# EAGLE design RH023.1 (EAGLE 7.1.0)
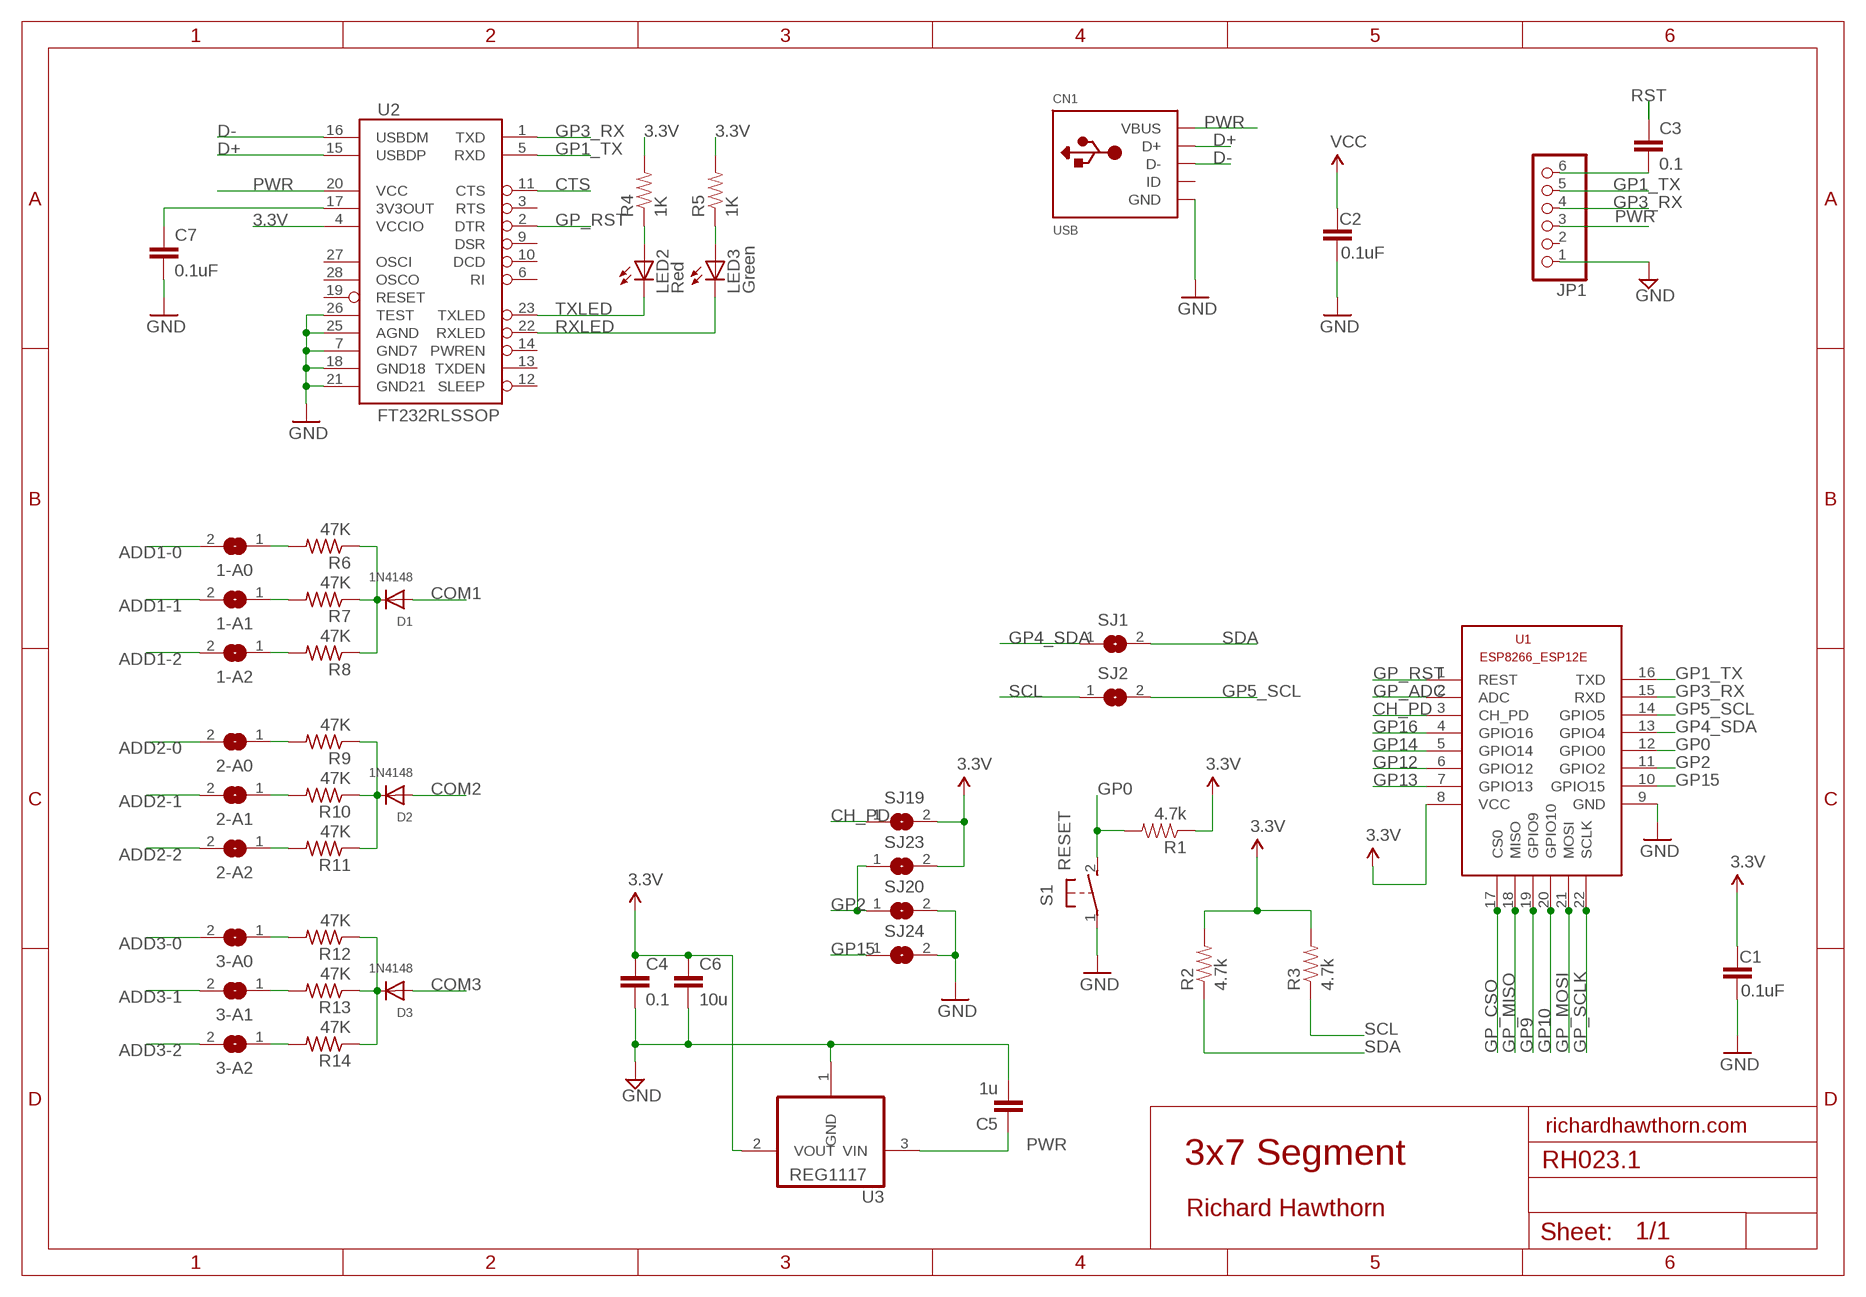
[diagram p0: schematic, sheet 1, part 1 of 2]
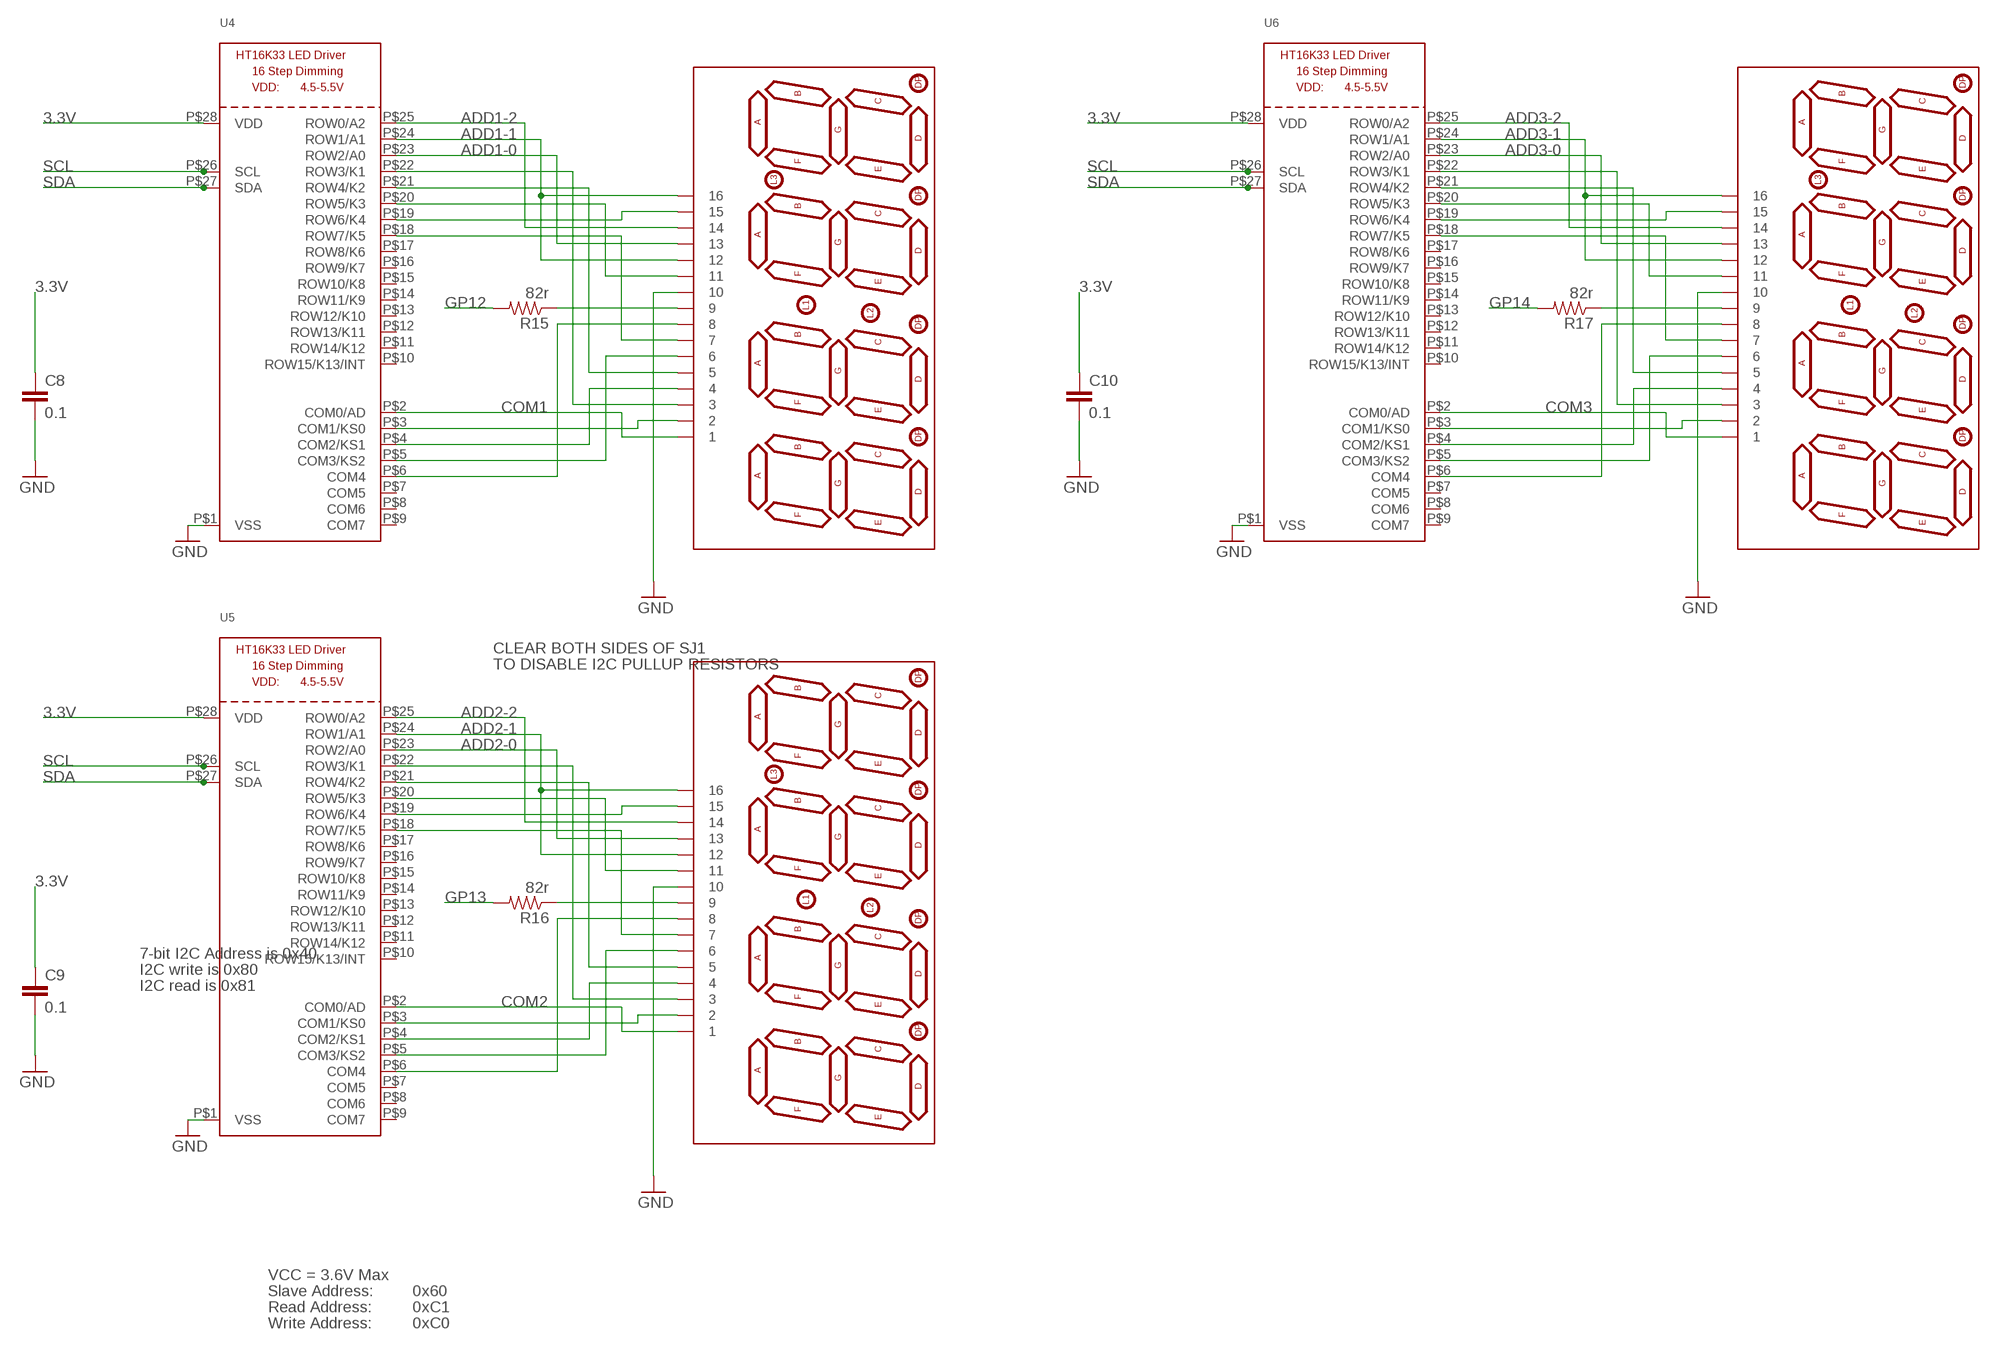
[diagram p1: schematic, sheet 1, part 2 of 2]

## Parts
1-A0  SOLDERJUMPERREFLOW_NOPASTE  [SOLDERJUMPER_REFLOW_NOPASTE]
1-A1  SOLDERJUMPERREFLOW_NOPASTE  [SOLDERJUMPER_REFLOW_NOPASTE]
1-A2  SOLDERJUMPERREFLOW_NOPASTE  [SOLDERJUMPER_REFLOW_NOPASTE]
2-A0  SOLDERJUMPERREFLOW_NOPASTE  [SOLDERJUMPER_REFLOW_NOPASTE]
2-A1  SOLDERJUMPERREFLOW_NOPASTE  [SOLDERJUMPER_REFLOW_NOPASTE]
2-A2  SOLDERJUMPERREFLOW_NOPASTE  [SOLDERJUMPER_REFLOW_NOPASTE]
3-A0  SOLDERJUMPERREFLOW_NOPASTE  [SOLDERJUMPER_REFLOW_NOPASTE]
3-A1  SOLDERJUMPERREFLOW_NOPASTE  [SOLDERJUMPER_REFLOW_NOPASTE]
3-A2  SOLDERJUMPERREFLOW_NOPASTE  [SOLDERJUMPER_REFLOW_NOPASTE]
C1  0.1uF  0.1UF-25V(+80/-20%)(0603)  [0603-CAP]
C2  0.1uF  0.1UF-25V(+80/-20%)(0603)  [0603-CAP]
C3  0.1  CAP0603-CAP  [0603-CAP]
C4  0.1  CAP0603-CAP  [0603-CAP]
C5  1u  CAP0603-CAP  [0603-CAP]
C6  10u  CAP0805-CAP  [0805-CAP]
C7  0.1uF  CAP0402-CAP  [0402-CAP]
C8  0.1  CAP0603-CAP  [0603-CAP]
C9  0.1  CAP0603-CAP  [0603-CAP]
C10  0.1  CAP0603-CAP  [0603-CAP]
CN1  USB  USBMINIB  [USB-MINIB]
D1  1N4148  DIODESOD-323F  [SOD-323F]
D2  1N4148  DIODESOD-323F  [SOD-323F]
D3  1N4148  DIODESOD-323F  [SOD-323F]
JP1  PINHD-1X6  [1X06]
LED1  7SEG-4DIGIT  [SPARKFUN_7-SEGMENT-4DIGIT]
LED2  Red  LED0603  [LED-0603]
LED3  Green  LED0603  [LED-0603]
LED4  7SEG-4DIGIT  [SPARKFUN_7-SEGMENT-4DIGIT]
LED5  7SEG-4DIGIT  [SPARKFUN_7-SEGMENT-4DIGIT]
R1  4.7k  RESISTOR0805-RES  [0805]
R2  4.7k  RESISTOR0805-RES  [0805]
R3  4.7k  RESISTOR0805-RES  [0805]
R4  1K  RESISTOR0402-RES  [0402-RES]
R5  1K  RESISTOR0402-RES  [0402-RES]
R6  47K  R-US_R0805  [R0805]
R7  47K  R-US_R0805  [R0805]
R8  47K  R-US_R0805  [R0805]
R9  47K  R-US_R0805  [R0805]
R10  47K  R-US_R0805  [R0805]
R11  47K  R-US_R0805  [R0805]
R12  47K  R-US_R0805  [R0805]
R13  47K  R-US_R0805  [R0805]
R14  47K  R-US_R0805  [R0805]
R15  82r  RESISTOR0805-RES  [0805]
R16  82r  RESISTOR0805-RES  [0805]
R17  82r  RESISTOR0805-RES  [0805]
S1  RESET  DTSM-3  [DTSM-3]
SJ1  SJ  [SJ]
SJ2  SJ  [SJ]
SJ19  SJ  [SJ]
SJ20  SJ  [SJ]
SJ23  SJ  [SJ]
SJ24  SJ  [SJ]
U1  ESP8266-12EESP8266-ESP12E  [ESP8266-ESP12E]
U2  FT232RLSSOP  [SSOP28DB]
U3  REG1117  [SOT223]
U4  HT16K33_SOP28  [SOP28_300MIL]
U5  HT16K33_SOP28  [SOP28_300MIL]
U6  HT16K33_SOP28  [SOP28_300MIL]

## Nets
3.3V: C1.1 C2.1 C4.1 C6.1 C8.1 C9.1 C10.1 R1.1 R2.2 R3.2 R4.2 R5.2 SJ19.2 SJ23.2 U1.8(VCC) U2.4(VCCIO) U3.2(VOUT) U4.P$28(VDD) U5.P$28(VDD) U6.P$28(VDD) ; supply symbol labelled VCC
3.3VOUT: C7.1 U2.17(3V3OUT)
ADD1-0: 1-A0.2 LED1.13 U4.P$23(ROW2/A0)
ADD1-1: 1-A1.2 LED1.12 LED1.16 U4.P$24(ROW1/A1)
ADD1-2: 1-A2.2 LED1.14 U4.P$25(ROW0/A2)
ADD2-0: 2-A0.2 LED4.13 U5.P$23(ROW2/A0)
ADD2-1: 2-A1.2 LED4.12 LED4.16 U5.P$24(ROW1/A1)
ADD2-2: 2-A2.2 LED4.14 U5.P$25(ROW0/A2)
ADD3-0: 3-A0.2 LED5.13 U6.P$23(ROW2/A0)
ADD3-1: 3-A1.2 LED5.12 LED5.16 U6.P$24(ROW1/A1)
ADD3-2: 3-A2.2 LED5.14 U6.P$25(ROW0/A2)
CH_PD: SJ19.1 U1.3(CH_PD)
COM1: D1.A LED1.1 U4.P$2(COM0/AD)
COM2: D2.A LED4.1 U5.P$2(COM0/AD)
COM3: D3.A LED5.1 U6.P$2(COM0/AD)
CTS: U2.11(CTS)
D+: CN1.D+ U2.15(USBDP)
D-: CN1.D- U2.16(USBDM)
GND [power]: C1.2 C2.2 C4.2 C5.2 C6.2 C7.2 C8.2 C9.2 C10.2 CN1.GND JP1.1 LED1.10 LED4.10 LED5.10 S1.1 SJ20.2 SJ24.2 U1.9(GND) U2.7(GND7) U2.18(GND18) U2.21(GND21) U2.25(AGND) U2.26(TEST) U3.1(GND) U4.P$1(VSS) U5.P$1(VSS) U6.P$1(VSS)
GP0: R1.2 S1.2 U1.12(GPIO0)
GP1_TX: JP1.5 U1.16(TXD) U2.5(RXD)
GP2: SJ20.1 SJ23.1 U1.11(GPIO2)
GP3_RX: JP1.4 U1.15(RXD) U2.1(TXD)
GP4_SDA: SJ1.1 U1.13(GPIO4)
GP5_SCL: SJ2.2 U1.14(GPIO5)
GP9: U1.19(GPIO9)
GP10: U1.20(GPIO10)
GP12: R15.2 U1.6(GPIO12)
GP13: R16.2 U1.7(GPIO13)
GP14: R17.2 U1.5(GPIO14)
GP15: SJ24.1 U1.10(GPIO15)
GP16: U1.4(GPIO16)
GP_ADC: U1.2(ADC)
GP_CSO: U1.17(CS0)
GP_MISO: U1.18(MISO)
GP_MOSI: U1.21(MOSI)
GP_RST: U1.1(REST) U2.2(DTR)
GP_SCLK: U1.22(SCLK)
N$1: LED1.9 R15.1
N$2: LED2.A R4.1
N$3: LED3.A R5.1
N$4: 2-A1.1 R10.2
N$5: 1-A0.1 R6.2
N$6: LED1.11 U4.P$20(ROW5/K3)
N$7: LED1.2 U4.P$3(COM1/KS0)
N$8: LED1.4 U4.P$4(COM2/KS1)
N$9: LED1.6 U4.P$5(COM3/KS2)
N$10: LED1.8 U4.P$6(COM4)
N$11: LED1.3 U4.P$22(ROW3/K1)
N$12: LED1.5 U4.P$21(ROW4/K2)
N$13: 2-A0.1 R9.2
N$14: LED1.7 U4.P$18(ROW7/K5)
N$15: LED1.15 U4.P$19(ROW6/K4)
N$16: D2.C R9.1 R10.1 R11.1
N$17: D1.C R6.1 R7.1 R8.1
N$18: 1-A2.1 R8.2
N$19: 1-A1.1 R7.2
N$20: C3.2 JP1.6
N$21: 2-A2.1 R11.2
N$22: 3-A1.1 R13.2
N$23: 3-A0.1 R12.2
N$24: D3.C R12.1 R13.1 R14.1
N$25: 3-A2.1 R14.2
N$26: LED4.2 U5.P$3(COM1/KS0)
N$27: LED4.4 U5.P$4(COM2/KS1)
N$28: LED4.6 U5.P$5(COM3/KS2)
N$29: LED4.8 U5.P$6(COM4)
N$30: LED4.3 U5.P$22(ROW3/K1)
N$31: LED4.5 U5.P$21(ROW4/K2)
N$32: LED4.15 U5.P$19(ROW6/K4)
N$33: LED4.11 U5.P$20(ROW5/K3)
N$34: LED4.7 U5.P$18(ROW7/K5)
N$35: LED4.9 R16.1
N$36: LED5.2 U6.P$3(COM1/KS0)
N$37: LED5.4 U6.P$4(COM2/KS1)
N$38: LED5.6 U6.P$5(COM3/KS2)
N$39: LED5.8 U6.P$6(COM4)
N$40: LED5.3 U6.P$22(ROW3/K1)
N$41: LED5.5 U6.P$21(ROW4/K2)
N$42: LED5.15 U6.P$19(ROW6/K4)
N$43: LED5.11 U6.P$20(ROW5/K3)
N$44: LED5.7 U6.P$18(ROW7/K5)
N$45: LED5.9 R17.1
PWR [power]: C5.1 CN1.VBUS JP1.3 U2.20(VCC) U3.3(VIN)
RST: C3.1
RXLED: LED3.C U2.22(RXLED)
SCL: R3.1 SJ2.1 U4.P$26(SCL) U5.P$26(SCL) U6.P$26(SCL)
SDA: R2.1 SJ1.2 U4.P$27(SDA) U5.P$27(SDA) U6.P$27(SDA)
TXLED: LED2.C U2.23(TXLED)
Unconnected: CN1.ID JP1.2 U2.3(RTS) U2.6(RI) U2.9(DSR) U2.10(DCD) U2.12(SLEEP) U2.13(TXDEN) U2.14(PWREN) U2.19(RESET) U2.27(OSCI) U2.28(OSCO) U4.P$7(COM5) U4.P$8(COM6) U4.P$9(COM7) U4.P$10(ROW15/K13/INT) U4.P$11(ROW14/K12) U4.P$12(ROW13/K11) U4.P$13(ROW12/K10) U4.P$14(ROW11/K9) U4.P$15(ROW10/K8) U4.P$16(ROW9/K7) U4.P$17(ROW8/K6) U5.P$7(COM5) U5.P$8(COM6) U5.P$9(COM7) U5.P$10(ROW15/K13/INT) U5.P$11(ROW14/K12) U5.P$12(ROW13/K11) U5.P$13(ROW12/K10) U5.P$14(ROW11/K9) U5.P$15(ROW10/K8) U5.P$16(ROW9/K7) U5.P$17(ROW8/K6) U6.P$7(COM5) U6.P$8(COM6) U6.P$9(COM7) U6.P$10(ROW15/K13/INT) U6.P$11(ROW14/K12) U6.P$12(ROW13/K11) U6.P$13(ROW12/K10) U6.P$14(ROW11/K9) U6.P$15(ROW10/K8) U6.P$16(ROW9/K7) U6.P$17(ROW8/K6)

## Notes on the sheet
- CLEAR BOTH SIDES OF SJ1
- TO DISABLE I2C PULLUP RESISTORS
- 7-bit I2C Address is 0x40
- I2C write is 0x80
- I2C read is 0x81
- richardhawthorn.com
- 3x7 Segment
- Richard Hawthorn
- VCC = 3.6V Max
- Slave Address: | 0x60
- Read Address: | 0xC1
- Write Address: | 0xC0

## Library data of the parts
1-A0 1-A1 1-A2 2-A0 2-A1 2-A2 3-A0 3-A1 3-A2 = microbuilder:SOLDERJUMPER: SMD Solder JUMPER Solder the two pads together to create a connection, or remove the solder to break it. REFLOW - Use this footprint for solder paste and reflow ovens. WAVE - Use this footprint for hand-soldering (larger pads). CLOSED - Has a trace between the two pads to ensure it is closed by default. The trace needs to be cut to disable the jumper, and can be closed again by creating a solder bridge between the two pads.
C1 C2 = SparkFun-Capacitors:0.1UF-25V(+80/-20%)(0603): Ceramic Standard decoupling cap CAP-00810; PROD_ID: CAP-00810
C3-C6 C8-C10 = LowPowerLab:CAP: Capacitor Standard 0603 ceramic capacitor, and 0.1" leaded capacitor.
C7 = SparkFun:CAP: Capacitor Standard 0603 ceramic capacitor, and 0.1" leaded capacitor.
CN1 = LowPowerLab:USB: USB Connectors USBMINIB - Surface Mount Female Mini-B USB Connector 4UConnector: 06564 By microbuilder.eu Thru-hole RA Female Mini-B USB Connector 4UConnector: 18732 By ladyada.net
D1-D3 = adafruit:DIODE: Diode SMADIODE - SMA Surface Mount Package 20V 1A Schottky Diode Digikey: 641-1014-6-ND DO-1N4148 - Through Hole Small Current Diode SOD-123 20V 1 A (.5mV Vf) Schottky Diode - Digikey: MBRX120TPMSCT-ND SOD-323 10V 570mA (.38mV Vf, 3ns) Schottky Diode - Digikey: ZLLS410CT-ND SOD-523 30V 30mA Schottky Diode (RB751S-40TE61) - Digikey: RB751S-40TE61CT-ND SOT23-R/W - SOT23 Package (R = Solder Paste/Reflow Ovens, W = Hand-Soldering) BAT54Film 40V 300mA - Digikey: 497-7162-1-ND
JP1 = Richards:PINHD-1X6: PIN HEADER
LED1 LED4 LED5 = sparkfun-4digit-sseg:7SEG-4DIGIT
LED2 LED3 = SparkFun:LED: LEDs Standard schematic elements and footprints for 5mm, 3mm, 1206, and 0603 sized LEDs. 5mm - Spark Fun Electronics SKU : COM-00529 (and others)
R1-R5 R15-R17 = SparkFun:RESISTOR: Resistor Basic schematic elements and footprints for 0603, 1206, and PTH resistors.
R6-R14 = adafruit:R-US_: RESISTOR, American symbol
S1 = switch-tact:DTSM-3
SJ1 SJ2 SJ19 SJ20 SJ23 SJ24 = jumper:SJ: SMD solder JUMPER
U1 = ESP8266-ESP12E:ESP8266-12E: ESP8266-12E with additional I/O and GPIO04/05 corrected The author cannot warrant that this library is free from error or will meet your specific requirements. Created by PuceBaboon.com. Komagane, Nagano, JAPAN
U2 = SparkFun:FT232RL: USB UART FT232RL 4th Generation USB UART (USB <-> Serial) Controller. Spark Fun Electronics SKU : COM-00650
U3 = burr-brown:REG1117: 800mA and 1A Low Dropout (LDO) Positive Regulator 1.8V, 2.5V, 2.85V, 3.3V, 5V, and Adj; MPN: REG1117; OC_FARNELL: 1097566; OC_NEWARK: 14P6981
U4-U6 = microbuilder:HT16K33_SOP28

## Net classes
1 power: width 0.381 mm, clearance 0.254 mm

## Board
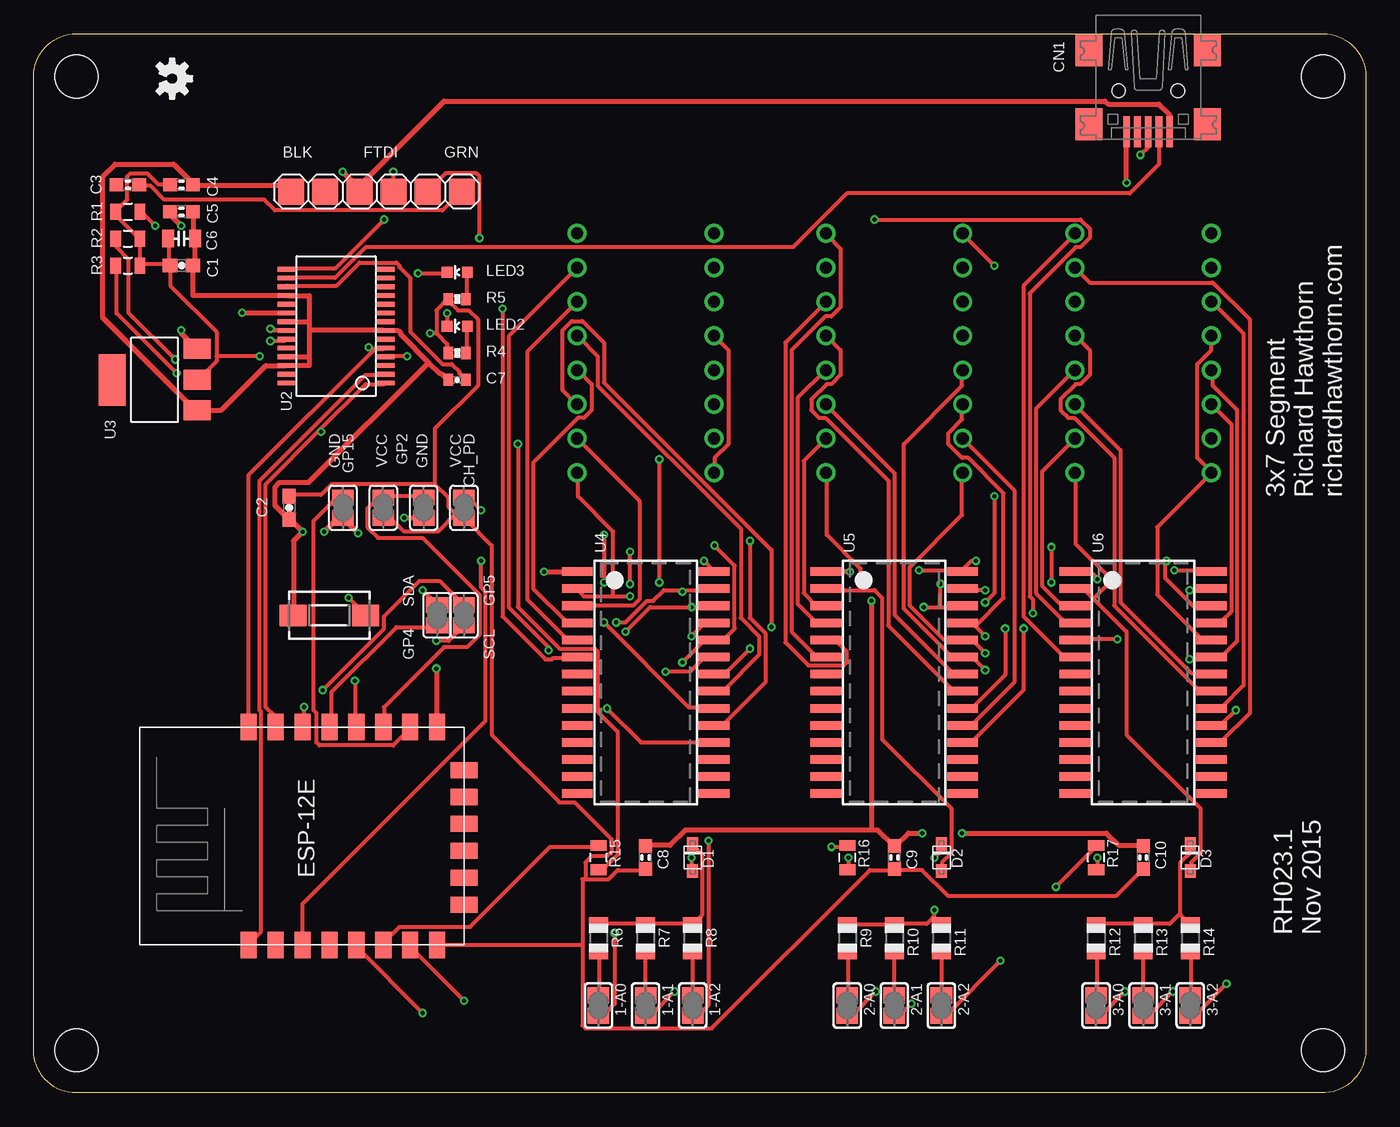
[diagram p2: board, top side]
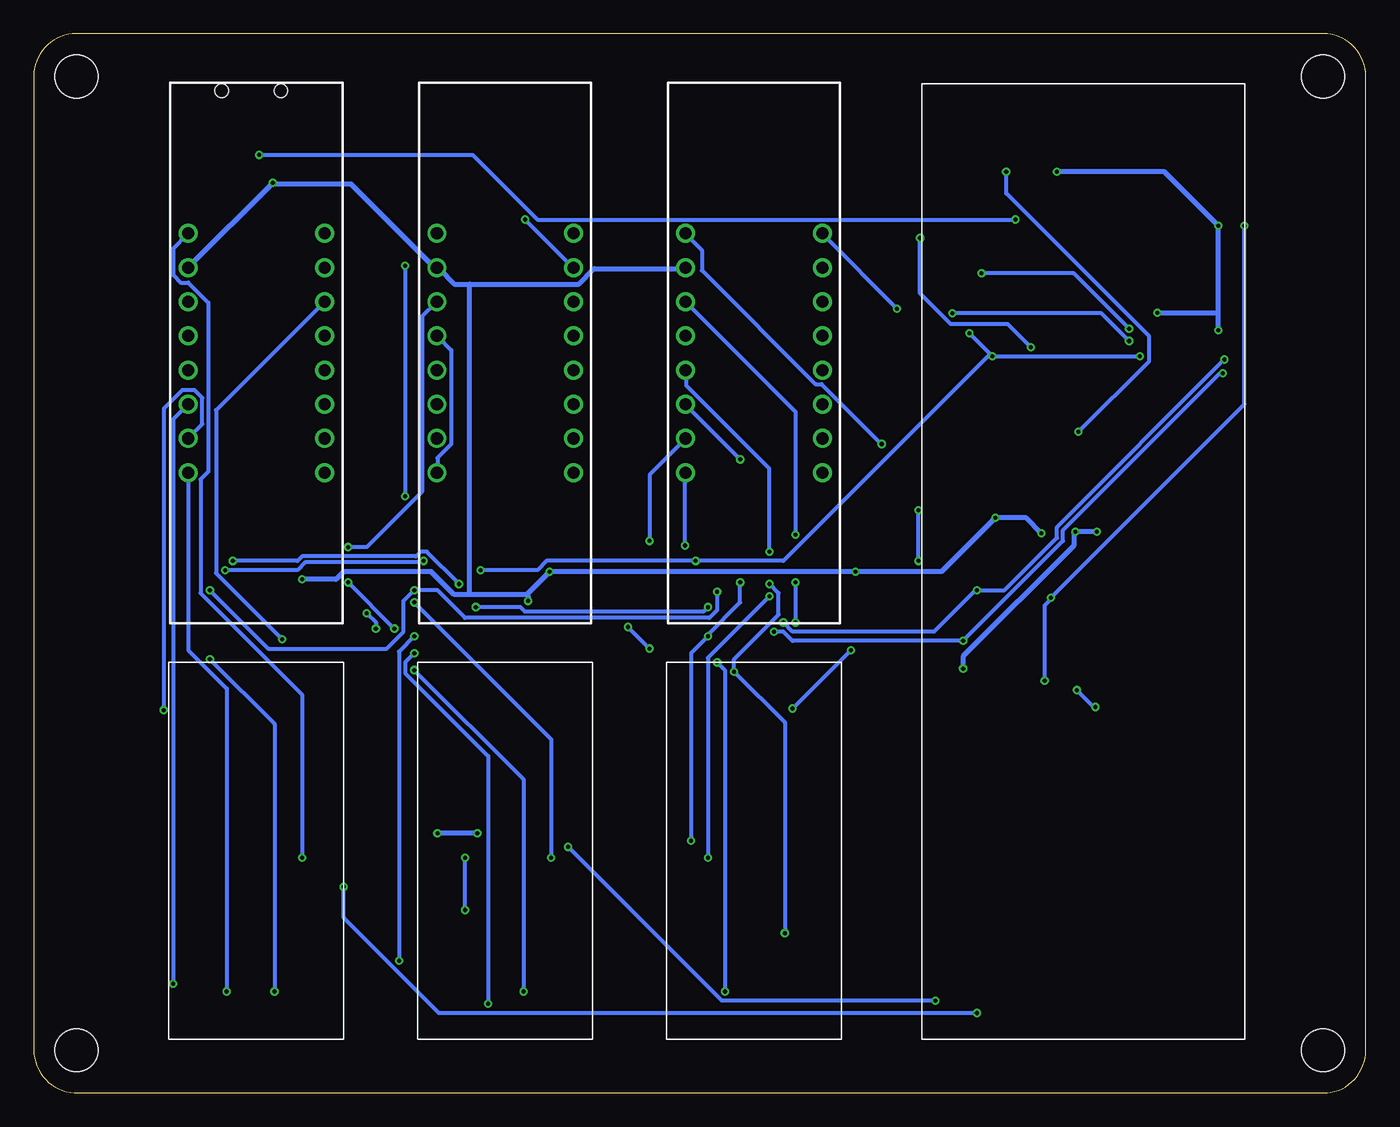
[diagram p3: board, bottom side, seen from below]

Size 99.06 x 78.74 mm. Coordinates in mm from the lower left corner, seen from the top.
Outline: 0,3.17 0,75.56 arc-90 3.17,78.74 95.89,78.74 arc-90 99.06,75.56 99.06,3.17 arc-90 95.76,0 3.17,0 arc-90 0,3.17
Copper layers (1*16): Top 0.035mm / dielectric 1.5mm / Bottom 0.035mm
Design rules "ITEADstudio_DRC *": minimum track width 12mil, minimum drill 12mil, track to track 6mil, track to pad 6mil, pad to pad 6mil, via to via 6mil, smd to smd 0mil, copper to edge 10mil, drill to drill 10mil, minimum pad ring 10mil, minimum via ring 6mil, stop-mask expansion 2mil, vias tented up to drill 100mil, thermal gap 15mil
Holes 3.2 mm at 3.17,3.17 95.89,3.17 3.17,75.56 95.89,75.56
tRestrict: area 0,0 to 15.5,30.5
bRestrict: area 0,0 to 15.5,30.5

### Footprints (pad centres in the part's own frame; a part is rotated, then mirrored left to right if it is on the bottom)
SOLDERJUMPER_REFLOW_NOPASTE = smd 1.168 x 1.6: 1 -0.762,0; 2 0.762,0
0603-CAP = smd 1.1 x 1: 1 -0.85,0; 2 0.85,0
0603-CAP' = smd 1.016 x 0.965: 1 -0.85,0; 2 0.85,0
0805-CAP = smd 0.902 x 1.3: 1 -1,0; 2 1,0
0402-CAP = smd 0.7 x 0.9: 1 -0.65,0; 2 0.65,0
USB-MINIB = smd 0.5 x 2.308: D+ 0,4.064; D- -0.8,4.064; GND 1.6,4.064; ID 0.8,4.064; VBUS -1.6,4.064 | smd 2 x 2.4: GND1 -4.4,-2; GND2 -4.4,3.5; GND3 4.4,3.5; GND4 4.4,-2 | hole 1: -2.2,1; 2.2,1
SOD-323F = smd 1 x 0.8: A -1,0; C 1,0
1X06 = smd 1.93 x 1.93: 1 -6.35,0; 2 -3.81,0; 3 -1.27,0; 4 1.27,0; 5 3.81,0; 6 6.35,0
SPARKFUN_7-SEGMENT-4DIGIT = drill 0.9: 1 -8.89,-5.08; 2 -6.35,-5.08; 3 -3.81,-5.08; 4 -1.27,-5.08; 5 1.27,-5.08; 6 3.81,-5.08; 7 6.35,-5.08; 8 8.89,-5.08; 9 8.89,5.08; 10 6.35,5.08; 11 3.81,5.08; 12 1.27,5.08; 13 -1.27,5.08; 14 -3.81,5.08; 15 -6.35,5.08; 16 -8.89,5.08
LED-0603 = smd 0.8 x 0.8: A 0,-0.75; C 0,0.75
0805 = smd 0.8 x 1.2: 1 -0.9,0; 2 0.9,0
0402-RES = smd 0.7 x 0.9: 1 -0.65,0; 2 0.65,0
R0805 = smd 1.1 x 1.4: 1 -1,0; 2 1,0
DTSM-3 = smd 2 x 1.6: 1 -2.7,0; 2 2.7,0
SJ = smd 1.168 x 1.6: 1 -0.762,0; 2 0.762,0
ESP8266-ESP12E = smd 2 x 1.2: 1 0,16; 2 0,14; 3 0,12; 4 0,10; 5 0,8; 6 0,6; 7 0,4; 8 0,2; 9 16.2,2; 10 16.2,4; 11 16.2,6; 12 16.2,8; 13 16.2,10; 14 16.2,12; 15 16.2,14; 16 16.2,16 | smd 1.2 x 2: 17 11,0; 18 3,0; 19 5,0; 20 13,0; 21 7,0; 22 9,0
SSOP28DB = smd 0.348 x 1.397: 1 -4.225,-3.656; 2 -3.575,-3.656; 3 -2.925,-3.656; 4 -2.275,-3.656; 5 -1.625,-3.656; 6 -0.975,-3.656; 7 -0.325,-3.656; 8 0.325,-3.656; 9 0.975,-3.656; 10 1.625,-3.656; 11 2.275,-3.656; 12 2.925,-3.656; 13 3.575,-3.656; 14 4.225,-3.656; 15 4.225,3.656; 16 3.575,3.656; 17 2.925,3.656; 18 2.275,3.656; 19 1.625,3.656; 20 0.975,3.656; 21 0.325,3.656; 22 -0.325,3.656; 23 -0.975,3.656; 24 -1.625,3.656; 25 -2.275,3.656; 26 -2.925,3.656; 27 -3.575,3.656; 28 -4.225,3.656
SOT223 = smd 1.499 x 2.007: 1 -2.261,-3.15; 2 0.025,-3.15; 3 2.311,-3.15 | smd 3.81 x 2.007: 4 0,3.15
SOP28_300MIL = smd 0.635 x 2.286: P$1 -8.255,-5.08; P$2 -6.985,-5.08; P$3 -5.715,-5.08; P$4 -4.445,-5.08; P$5 -3.175,-5.08; P$6 -1.905,-5.08; P$7 -0.635,-5.08; P$8 0.635,-5.08; P$9 1.905,-5.08; P$10 3.175,-5.08; P$11 4.445,-5.08; P$12 5.715,-5.08; P$13 6.985,-5.08; P$14 8.255,-5.08; P$15 8.255,5.08; P$16 6.985,5.08; P$17 5.715,5.08; P$18 4.445,5.08; P$19 3.175,5.08; P$20 1.905,5.08; P$21 0.635,5.08; P$22 -0.635,5.08; P$23 -1.905,5.08; P$24 -3.175,5.08; P$25 -4.445,5.08; P$26 -5.715,5.08; P$27 -6.985,5.08; P$28 -8.255,5.08

### Placement (x,y rotation side)
1-A0  42,6.5 270 top
1-A1  45.5,6.5 270 top
1-A2  49,6.5 270 top
2-A0  60.5,6.5 270 top
2-A1  64,6.5 270 top
2-A2  67.5,6.5 270 top
3-A0  79,6.5 270 top
3-A1  82.5,6.5 270 top
3-A2  86,6.5 270 top
C1  11,61.5 0 top
C2  19,43.5 270 top
C3  0.1  [0603-CAP']  7,67.5 0 top
C4  0.1  [0603-CAP']  11,67.5 0 top
C5  1u  [0603-CAP']  11,65.5 0 top
C6  11,63.5 0 top
C7  31.5,53 180 top
C8  0.1  [0603-CAP']  45.5,17.5 90 top
C9  0.1  [0603-CAP']  64,17.5 90 top
C10  0.1  [0603-CAP']  82.5,17.5 90 top
CN1  82.87,75.5 180 top
D1  49,17.5 90 top
D2  67.5,17.5 90 top
D3  86,17.5 90 top
JP1  25.5,67 0 top
LED1  45.5,55 90 bottom
LED2  31.5,57 90 top
LED3  31.5,61 90 top
LED4  64,55 90 bottom
LED5  82.5,55 90 bottom
R1  7,65.5 0 top
R2  7,63.5 0 top
R3  7,61.5 0 top
R4  31.5,55 180 top
R5  31.5,59 180 top
R6  42,11.5 270 top
R7  45.5,11.5 270 top
R8  49,11.5 270 top
R9  60.5,11.5 270 top
R10  64,11.5 270 top
R11  67.5,11.5 270 top
R12  79,11.5 270 top
R13  82.5,11.5 270 top
R14  86,11.5 270 top
R15  42,17.5 90 top
R16  60.5,17.5 90 top
R17  79,17.5 90 top
S1  22,35.5 0 top
SJ1  30,35.5 90 top
SJ2  32,35.5 90 top
SJ19  32,43.5 270 top
SJ20  29,43.5 270 top
SJ23  26,43.5 270 top
SJ24  23,43.5 270 top
U1  32,11 90 top
U2  22.5,57 90 top
U3  9,53 90 top
U4  45.5,30.5 270 top
U5  64,30.5 270 top
U6  82.5,30.5 270 top
U$3  [OSHW-LOGO-S]  10.3,75.4 270 top

### Tracks (layer width: path | path; a pad name or v marks a point on that pad's centre or on a via)
3.3V  (via drill 0.3)
  Top 0.305: C10.1 82.41,16.57 80.47,14.63 68.01,14.63 66.06,16.57 64.01,16.57 C9.1 63.89,16.57 62.18,16.57 50.41,4.8 41.03,4.8 40.8,5.03 40.8,10.97 | 41.03,15.89 40.8,15.89 40.8,10.97 | 41.03,15.89 42.75,15.89 43.43,16.57 45.49,16.57 C8.1 | C4.1 10.06,67.55 9.26,67.55 8.46,68.35 7.2,68.35 6.97,68.12 6.97,66.41 6.17,65.61 R1.1 6.17,65.38 6.17,65.15 7.77,63.55 R2.2 7.89,63.44 7.89,61.61 R3.2 8,61.61 9.94,61.61 C1.1 | C1.1 10.06,61.61 10.06,63.44 C6.1 | 13.6,54.75 13.6,56.58 10.17,60.01 10.17,61.38 C1.1 | 13.6,54.75 13.6,54.41 12.23,53.03 U3.2 | 29.83,45.26 22.17,45.26 21.37,44.46 19.09,44.46 C2.1 | 29.83,45.26 30.86,44.23 30.86,43.55 31.66,42.75 31.89,42.75 SJ19.2 | SJ23.2 26.06,42.63 26.63,42.63 27.55,41.72 30.06,41.72 31.32,42.98 SJ19.2 | 29.95,56.46 30.75,55.66 30.75,55.09 R4.2 | 29.95,56.46 29.95,58.18 30.75,58.98 R5.2 30.86,58.86 31.55,58.18 32.35,58.18 33.03,57.49 33.03,52.58 29.83,49.38 29.83,45.26 | v27.77,54.75 26.18,54.75 U2.4 | 29.95,56.46 v29.49,56.46 | v49.84,39.55 50.52,38.86 U4.P$28 | v65.84,38.86 69.04,38.86 U5.P$28 69.15,38.98 69.72,39.55 v70.07,39.55 | v84.81,38.86 87.55,38.86 U6.P$28 | v16.8,54.75 13.6,54.75 | 40.8,10.97 30.06,10.97 U1.8 | 41.03,15.89 41.03,17.14 41.49,17.6 42.63,17.6 42.98,17.95 42.98,18.86 40.23,21.6 39.09,21.6 34.06,26.63 34.06,40.69 32.12,42.63 SJ19.2
  Bottom 0.305: v29.49,56.46 v27.77,54.75 | v27.77,54.75 28,54.86 43.32,39.55 v49.84,39.55 60.92,39.55 61.61,38.86 v65.84,38.86 | v84.81,38.86 79.44,38.86 78.87,39.43 70.18,39.43 v70.07,39.55 | v27.77,54.75 v16.8,54.75
3.3VOUT
  Top 0.305: C7.1 32.12,53.03 31.66,53.49 31.66,53.61 31.09,54.18 30.4,54.18 28,56.58 28,60.58 27.2,61.38 27.2,61.49 26.98,61.72 24.23,61.72 22.52,60.01 18.86,60.01 U2.17
ADD1-0  (via drill 0.3)
  Top 0.305: v43.2,11.89 43.2,6.63 42.41,5.83 42.06,5.83 1-A0.2 | v46.98,31.32 48.81,31.32 49.84,32.35 50.52,32.35 U4.P$23 | v44.35,37.83 v44.35,40.23
  Bottom 0.305: v43.2,11.89 43.2,27.55 v46.98,31.32 46.98,32.23 43.66,35.55 43.66,37.15 v44.35,37.83 | v44.35,40.23 44.35,46.41 50.52,52.58 50.52,53.72 LED1.13
ADD1-1  (via drill 0.3)
  Top 0.305: LED1.16 50.63,46.18 50.63,47.21 51.66,48.23 51.66,55.21 50.63,56.24 LED1.12 | v47.66,7.54 45.95,5.83 45.61,5.83 1-A1.2 | v48.23,32 49.84,33.6 50.52,33.6 U4.P$24 50.63,33.72 51.32,33.72 52.12,34.52 52.12,39.2 v50.63,40.69
  Bottom 0.305: v47.66,7.54 47.66,31.43 v48.23,32 | v50.63,40.69 50.63,46.06 LED1.16
ADD1-2  (via drill 0.3)
  Top 0.305: v50.18,18.75 50.18,6.51 49.49,5.83 49.03,5.83 1-A2.2 | v48.92,33.95 49.84,34.86 50.52,34.86 U4.P$25 | v46.52,37.95 v46.52,47.09
  Bottom 0.305: v50.18,18.75 50.18,32.69 v48.92,33.95 48.92,34.06 46.52,36.46 v46.52,37.95 | v46.52,47.09 50.52,51.09 LED1.14
ADD2-0  (via drill 0.3)
  Top 0.305: v62.64,7.54 60.92,5.83 60.58,5.83 2-A0.2 | v70.75,31.43 69.84,32.35 69.15,32.35 U5.P$23 69.04,32.46 68.24,32.46 64.69,36.01 64.69,48.23 69.04,52.58 69.04,53.72 LED4.13
  Bottom 0.305: v62.64,7.54 62.64,23.32 v70.75,31.43
ADD2-1  (via drill 0.3)
  Top 0.305: v65.27,6.63 64.47,5.83 64.01,5.83 2-A1.2 | v70.75,32.69 69.84,33.6 69.15,33.6 U5.P$24 69.04,33.72 67.67,33.72 65.15,36.23 65.15,39.09 69.04,42.98 69.04,46.06 LED4.16
  Bottom 0.305: LED4.16 69.04,46.18 69.04,47.21 68.01,48.23 68.01,55.21 69.04,56.24 LED4.12 | v65.27,6.63 65.27,25.03 71.44,31.2 71.44,32 v70.75,32.69
ADD2-2  (via drill 0.3)
  Top 0.305: v71.89,9.83 67.89,5.83 67.55,5.83 2-A2.2 | v70.75,33.95 69.84,34.86 69.15,34.86 U5.P$25 70.07,34.75 72.12,36.8 72.12,44.58 69.49,47.21 69.04,47.21 68.01,48.23 68.01,49.03 69.04,50.06 69.04,51.09 LED4.14
  Bottom 0.305: v71.89,9.83 71.89,32.8 v70.75,33.95
ADD3-0  (via drill 0.3)
  Top 0.305: v81.15,7.54 79.44,5.83 79.1,5.83 3-A0.2 | v85.95,32.23 87.44,32.23 87.55,32.35 U6.P$23 87.67,32.46 88.35,32.46 89.5,33.6 89.5,50.75 87.67,52.58 87.67,53.72 LED5.13
  Bottom 0.305: v81.15,7.54 81.15,27.43 v85.95,32.23
ADD3-1  (via drill 0.3)
  Top 0.305: v84.7,7.54 82.98,5.83 82.53,5.83 3-A1.2 | U6.P$24 87.55,33.72 86.87,33.72 83.55,37.03 83.55,42.06 87.55,46.06 LED5.16 87.55,46.18 86.53,47.21 86.53,54.18 87.55,55.21 87.55,56.24 LED5.12
  Bottom 0.305: v84.7,7.54 84.7,30.06 87.55,32.92 87.55,46.06 LED5.16
ADD3-2  (via drill 0.3)
  Top 0.305: v88.7,8.12 86.41,5.83 86.07,5.83 3-A2.2 | U6.P$25 87.67,34.98 88.24,34.98 89.04,35.78 89.04,49.72 87.67,51.09 LED5.14
  Bottom 0.305: v88.7,8.12 88.7,50.06 87.67,51.09 LED5.14
CH_PD  (via drill 0.3)
  Top 0.305: v33.26,43.32 32.35,44.23 32,44.23 SJ19.1 | v33.26,39.55 33.26,37.6 33.6,37.26 33.6,27.66 20,14.06 20,11.09 U1.3
  Bottom 0.305: v33.26,39.55 v33.26,43.32
COM1  (via drill 0.3)
  Top 0.305: v48.92,17.49 48.92,16.57 D1.A | 43.09,36.92 40.92,36.92 40.46,37.38 U4.P$2 | 43.09,36.92 v44.35,36.92 | 43.09,36.92 43.09,41.72 40.46,44.35 40.46,46.06 LED1.1
  Bottom 0.305: v48.92,17.49 48.92,32.35 v44.35,36.92
COM2
  Top 0.305: 61.49,37.38 58.98,37.38 U5.P$2 | 61.49,37.38 62.52,37.38 63.09,36.8 63.09,26.29 68.24,21.14 68.24,17.83 67.55,17.14 67.55,16.57 D2.A | 61.49,37.38 61.49,38.98 58.98,41.49 58.98,46.06 LED4.1
COM3
  Top 0.305: 78.81,36.75 78.18,37.38 77.5,37.38 U6.P$2 | 78.81,36.75 81.27,34.29 81.27,26.63 86.75,21.14 86.75,17.83 86.07,17.14 86.07,16.57 D3.A | 78.81,36.75 79.9,37.83 79.9,38.41 77.5,40.8 77.5,46.06 LED5.1
D+  (via drill 0.3)
  Top 0.305: v26.06,64.92 22.4,61.27 18.86,61.27 U2.15 | v82.3,69.72 82.87,70.29 82.87,71.32 CN1.D+
  Bottom 0.305: v26.06,64.92 61.61,64.92 66.41,69.72 v82.3,69.72
D-
  Top 0.305: U2.16 18.86,60.58 22.4,60.58 24.69,62.87 56.46,62.87 60.47,66.86 81.5,66.86 83.67,69.04 83.67,71.32 CN1.D-
GND  (via drill 0.3)
  Top 0.381: 20.5,57.33 20.5,59.27 U2.18 11.85,59.27 C1.2 12,61.61 12,63.32 C6.2 11.89,63.55 11.89,65.49 C5.2 | 20.5,57.33 20.5,56.69 | 20.5,56.69 20.5,54.73 | 20.5,54.73 20.5,54.08 U2.26 18.75,54.06 17.26,54.06 13.95,50.75 12.34,50.75 U3.1 12,50.75 5.14,57.61 5.14,68.12 6.06,69.04 10.4,69.04 11.77,67.67 C4.2 11.89,67.44 18.75,67.44 19.09,67.09 JP1.1 | U2.25 20.5,54.73 | U2.21 20.5,57.33 | v81.27,67.67 81.27,71.32 CN1.GND | 29.38,54.29 27.32,56.35 27.32,56.46 27.09,56.69 26.18,56.69 U2.7 26.06,56.69 20.5,56.69 | 29.38,54.29 30.18,53.49 30.29,53.49 30.75,53.03 C7.2 | v69.04,19.32 79.78,19.32 80.7,18.4 82.41,18.4 C10.2 | v66.06,19.32 65.04,19.32 64.12,18.4 C9.2 63.89,18.4 62.75,19.55 62.29,19.55 | 29.38,54.29 20.46,45.38 18.29,45.38 17.95,45.03 17.95,43.66 18.86,42.75 C2.2 19.09,42.63 v20,41.72 19.32,41.03 19.32,35.55 S1.1 | 62.29,19.55 48.46,19.55 47.32,18.4 45.61,18.4 C8.2 | v21.6,41.72 22.52,42.63 22.97,42.63 SJ24.2 23.09,42.63 v24.12,41.6 | v27.55,42.75 28.92,42.75 SJ20.2 | v29.95,31.55 29.95,27.2 U1.9 | v37.95,38.75 40.35,38.75 U4.P$1 | v60.69,38.75 58.98,38.75 U5.P$1 | v79.1,38.18 78.52,38.75 77.5,38.75 U6.P$1 | v62.29,36.58 62.29,19.55
  Bottom 0.381: LED5.10 87.55,61.38 v81.27,67.67 81.15,67.55 75.44,67.55 69.27,61.38 LED4.10 68.92,61.27 67.78,60.12 66.64,60.12 | v66.06,19.32 v69.04,19.32 | 66.64,60.12 58.52,60.12 57.38,61.27 50.63,61.27 LED1.10 | v20,41.72 v21.6,41.72 21.72,41.6 21.72,40.69 29.95,32.46 v29.95,31.55 | v24.12,41.6 25.26,42.75 v27.55,42.75 31.55,38.75 v37.95,38.75 v60.69,38.75 62.41,37.03 | v79.1,38.18 76.58,38.18 76.01,38.75 69.49,38.75 67.78,37.03 66.64,37.03 | 62.41,37.03 66.64,37.03 | v62.29,36.58 62.29,36.92 62.41,37.03 | 66.64,37.03 66.64,60.12
GP0  (via drill 0.3)
  Top 0.305: v9.03,64.47 8,65.49 R1.2 | v23.43,36.8 24.69,35.55 S1.2 | v23.89,30.63 23.89,27.2 U1.12
  Bottom 0.305: v9.03,64.47 9.03,51.21 v23.43,36.8 23.43,36.69 23.89,36.23 v23.89,30.63
GP1_TX  (via drill 0.3)
  Top 0.305: 25.2,55.15 16,45.95 U1.16 | 25.2,55.15 25.38,55.32 26.06,55.32 U2.5 | v33.15,63.55 33.15,68.12 32.92,68.35 30.63,68.35 29.38,67.09 JP1.5 | 25.2,55.15 v24.92,55.44
  Bottom 0.305: v33.15,63.55 33.15,59.44 30.86,57.15 26.63,57.15 v24.92,55.44
GP2
  Top 0.305: SJ20.1 28.92,44.35 26.06,44.35 SJ23.1 25.95,44.12 25.49,44.12 24.8,43.43 24.8,42.06 25.6,41.26 28.92,41.26 33.15,37.03 33.15,34.06 32.23,33.15 30.52,33.15 26.06,28.69 26.06,27.2 U1.11
GP3_RX  (via drill 0.3)
  Top 0.305: 21.2,49.21 17.26,45.26 17.26,28.69 17.95,28 17.95,27.2 U1.15 | 21.2,49.21 24.69,52.69 26.06,52.69 U2.1 | v26.75,68.47 26.75,67.09 JP1.4 | v21.37,49.15 21.26,49.15 21.2,49.21
  Bottom 0.305: v26.75,68.47 26.75,66.86 16.12,56.24 16.12,54.41 v21.37,49.15
GP4_SDA
  Top 0.305: SJ1.1 29.95,34.63 26.98,34.63 22.17,29.83 22.17,27.32 22.06,27.2 U1.13
GP5_SCL  (via drill 0.3)
  Top 0.305: v21.49,29.95 26.06,34.52 26.06,35.43 28.69,38.06 30.18,38.06 31.89,36.35 SJ2.2 | v20.12,28.69 20.12,27.32 U1.14
  Bottom 0.305: v21.49,29.95 20.23,28.69 v20.12,28.69
GP12
  Top 0.305: R15.2 41.95,18.29 38.41,18.29 32.46,12.34 27.2,12.34 25.95,11.09 U1.6
GP13  (via drill 0.3)
  Top 0.305: v59.32,18.29 60.47,18.29 R16.2 | v32,6.86 27.89,10.97 U1.7
  Bottom 0.305: v59.32,18.29 47.89,6.86 v32,6.86
GP14  (via drill 0.3)
  Top 0.305: v76.01,15.32 78.98,18.29 R17.2 | v28.92,5.94 23.89,10.97 U1.5
  Bottom 0.305: v76.01,15.32 76.01,13.03 68.92,5.94 v28.92,5.94
GP15
  Top 0.305: SJ24.1 22.97,44.23 22.52,44.23 20.8,42.52 20.8,28.46 21.03,28.23 21.03,26.06 21.26,25.83 26.75,25.83 28,27.09 U1.10
GP_RST
  Top 0.305: U2.2 26.06,53.38 24.69,53.38 16.8,45.49 16.8,28.46 16.92,28.35 16.92,12 16,11.09 U1.1
N$1  (via drill 0.3)
  Top 0.305: v36.01,48.23 36.01,36.12 39.09,33.03 41.72,33.03 41.95,32.8 41.95,28.35 43.43,26.86 43.43,17.72 42.41,16.69 42.06,16.69 R15.1
  Bottom 0.305: v36.01,48.23 40.46,52.69 40.92,52.69 49.38,61.15 49.38,62.64 50.52,63.78 LED1.9
N$2
  Top 0.305: LED2.A 32.23,56.92 32.23,55.09 R4.1
N$3
  Top 0.305: LED3.A 32.23,60.92 32.23,59.09 R5.1
N$4
  Top 0.305: R10.2 64.01,10.4 64.01,7.32 2-A1.1
N$5
  Top 0.305: R6.2 42.06,10.4 42.06,7.32 1-A0.1
N$6  (via drill 0.3)
  Top 0.305: v42.41,34.98 48.69,28.69 50.52,28.69 U4.P$20 | v42.41,41.49 v42.41,37.95
  Bottom 0.305: v42.41,37.95 v42.41,34.98 | v42.41,41.49 42.41,50.63 50.52,58.75 LED1.11
N$7
  Top 0.305: U4.P$3 40.46,36.23 44.58,36.23 45.03,36.69 45.03,44.01 40.46,48.58 LED1.2
N$8
  Top 0.305: U4.P$4 40.35,34.98 39.66,34.98 37.15,37.49 37.15,46.86 40.46,50.18 40.92,50.18 41.49,50.75 41.49,52.69 40.46,53.72 LED1.4
N$9
  Top 0.305: U4.P$5 40.35,33.72 39.66,33.72 36.69,36.69 36.69,55.09 40.35,58.75 LED1.6
N$10  (via drill 0.3)
  Top 0.305: v34.86,58.29 34.86,35.43 38.06,32.23 38.52,32.23 38.63,32.35 40.35,32.35 U4.P$6
  Bottom 0.305: v34.86,58.29 40.35,63.78 LED1.8
N$11  (via drill 0.3)
  Top 0.305: v53.26,33.03 51.44,31.2 50.63,31.2 U4.P$22 | v54.86,34.63 54.86,40.35 42.41,52.81 42.41,55.78 40.8,57.38 40.01,57.38 39.32,56.69 39.32,52.23 40.35,51.21 LED1.3
  Bottom 0.305: v54.86,34.63 v53.26,33.03
N$12
  Top 0.305: U4.P$21 50.63,29.95 51.32,29.95 53.95,32.58 53.95,33.95 52.58,35.32 52.58,41.95 41.95,52.58 41.95,54.75 40.46,56.24 LED1.5
N$13
  Top 0.305: R9.2 60.58,9.94 60.58,7.32 2-A0.1
N$14  (via drill 0.3)
  Top 0.305: v42.63,28.57 45.15,26.06 50.52,26.06 U4.P$18 | v38.29,32.92 38.29,33.15 35.32,36.12 35.32,56.24 40.35,61.27 LED1.7
  Bottom 0.305: v38.29,32.92 v42.63,28.57
N$15  (via drill 0.3)
  Top 0.305: v53.26,41.03 53.26,35.32 54.41,34.18 54.41,30.52 51.32,27.43 50.63,27.43 U4.P$19
  Bottom 0.305: v53.26,41.03 53.26,45.95 50.63,48.58 LED1.15
N$16  (via drill 0.3)
  Top 0.305: R9.1 60.58,12.5 63.44,12.5 63.89,12.46 R10.1 64.12,12.57 66.41,12.57 66.86,13.03 R11.1 67.44,12.57 66.98,13.03 v66.98,13.6 | v66.98,17.49 67.44,17.95 67.44,18.4 D2.C
  Bottom 0.305: v66.98,13.6 v66.98,17.49
N$17
  Top 0.305: R6.1 42.06,12.57 45.49,12.57 R7.1 45.61,12.57 48.92,12.57 R8.1 49.03,12.57 49.72,13.26 49.72,17.72 49.03,18.4 D1.C
N$18
  Top 0.305: R8.2 49.03,10.4 49.03,7.32 1-A2.1
N$19
  Top 0.305: R7.2 45.49,10.4 45.49,7.32 1-A1.1
N$20
  Top 0.305: C3.2 7.89,67.44 8.69,67.44 9.72,66.41 17.14,66.41 17.95,65.61 30.4,65.61 31.77,66.98 JP1.6
N$21
  Top 0.305: R11.2 67.55,10.4 67.55,7.32 2-A2.1
N$22
  Top 0.305: R13.2 82.53,10.4 82.53,7.32 3-A1.1
N$23
  Top 0.305: R12.2 79.1,10.4 79.1,7.32 3-A0.1
N$24
  Top 0.305: R12.1 79.1,12.57 82.41,12.57 R13.1 82.64,12.57 84.47,12.57 85.15,13.26 85.27,13.26 | 85.27,13.26 85.27,17.14 85.95,17.83 85.95,18.4 D3.C | 85.27,13.26 85.95,12.57 R14.1
N$25
  Top 0.305: R14.2 86.07,10.4 86.07,7.32 3-A2.1
N$26
  Top 0.305: U5.P$3 58.86,36.23 58.18,36.23 57.26,37.15 57.26,46.98 58.86,48.58 LED4.2
N$27
  Top 0.305: U5.P$4 58.86,34.98 58.18,34.98 56.81,36.35 56.81,51.66 58.86,53.72 LED4.4
N$28
  Top 0.305: U5.P$5 58.98,33.6 59.66,33.6 60.47,32.8 60.47,32 60.24,31.77 57.61,31.77 55.89,33.49 55.89,55.78 58.86,58.75 LED4.6
N$29
  Top 0.305: U5.P$6 58.86,32.46 58.18,32.46 56.35,34.29 56.35,55.21 58.86,57.72 59.32,57.72 60.01,58.41 60.01,62.75 58.98,63.78 LED4.8
N$30
  Top 0.305: U5.P$22 69.04,31.2 68.35,31.2 64.01,35.55 64.01,46.06 58.98,51.09 LED4.3
N$31
  Top 0.305: U5.P$21 69.04,29.95 68.35,29.95 63.55,34.75 63.55,45.49 58.86,50.18 58.41,50.18 57.84,50.75 57.84,51.55 58.98,52.69 59.32,52.69 60.01,53.38 60.01,55.21 58.98,56.24 LED4.5
N$32
  Top 0.305: U5.P$19 69.15,27.43 69.84,27.43 72.92,30.52 72.92,44.81 69.15,48.58 LED4.15
N$33  (via drill 0.3)
  Top 0.305: v72.24,34.52 72.24,31.09 69.84,28.69 69.15,28.69 U5.P$20 | v75.67,40.58 v75.67,37.95
  Bottom 0.305: v75.67,37.95 v72.24,34.52 | v75.67,40.58 74.3,40.58 70.18,44.69 70.18,57.72 69.15,58.75 LED4.11
N$34  (via drill 0.3)
  Top 0.305: v73.61,34.52 73.61,29.95 69.72,26.06 69.15,26.06 U5.P$18 | v74.3,35.66 74.3,36.69 74.07,36.92 74.07,59.44 77.5,62.87 77.84,62.87 78.52,63.55 78.52,64.24 77.84,64.92 v62.52,64.92
  Bottom 0.305: v73.61,34.52 73.61,34.98 v74.3,35.66 | v62.52,64.92 58.98,61.38 LED4.7
N$35  (via drill 0.3)
  Top 0.305: v60.58,17.49 60.58,16.69 R16.1 | v70.75,36.46 71.44,37.15 v71.44,44.35 | v71.44,61.49 69.15,63.78 LED4.9
  Bottom 0.305: v60.58,17.49 60.58,26.29 v70.75,36.46 | v71.44,61.49 v71.44,44.35
N$36
  Top 0.305: U6.P$3 77.38,36.23 76.47,36.23 74.98,37.72 74.98,46.18 77.38,48.58 LED5.2
N$37
  Top 0.305: U6.P$4 77.38,34.98 76.69,34.98 74.52,37.15 74.52,50.86 77.38,53.72 LED5.4
N$38  (via drill 0.3)
  Top 0.305: v80.58,33.72 77.5,33.72 U6.P$5
  Bottom 0.305: v80.58,33.72 85.5,38.63 85.5,50.75 77.5,58.75 LED5.6
N$39
  Top 0.305: U6.P$6 77.38,32.46 76.58,32.46 73.61,35.43 73.61,60.01 77.38,63.78 LED5.8
N$40
  Top 0.305: U6.P$22 87.55,31.2 86.07,31.2 80.81,36.46 80.81,47.78 77.5,51.09 LED5.3
N$41
  Top 0.305: U6.P$21 87.55,29.95 86.64,29.95 80.35,36.23 80.35,47.21 77.38,50.18 76.92,50.18 76.35,50.75 76.35,51.55 77.5,52.69 77.84,52.69 78.52,53.38 78.52,55.21 77.5,56.24 LED5.5
N$42  (via drill 0.3)
  Top 0.305: v89.38,28.46 88.35,27.43 87.67,27.43 U6.P$19
  Bottom 0.305: v89.38,28.46 89.38,50.86 88.01,52.23 87.1,52.23 86.53,51.66 86.53,49.72 87.55,48.69 LED5.15
N$43
  Top 0.305: U6.P$20 87.67,28.69 88.35,28.69 89.95,30.29 89.95,56.46 87.67,58.75 LED5.11
N$44
  Top 0.305: U6.P$18 87.67,26.06 88.24,26.06 90.41,28.23 90.41,57.49 87.67,60.24 78.52,60.24 77.5,61.27 LED5.7
N$45  (via drill 0.3)
  Top 0.305: v79.1,17.49 79.1,16.69 R17.1
  Bottom 0.305: v79.1,17.49 79.1,29.6 86.64,37.15 86.64,45.61 86.07,46.18 86.07,58.75 87.55,60.24 88.12,60.24 88.7,60.81 88.7,62.75 87.67,63.78 LED5.9
PWR  (via drill 0.3)
  Top 0.381: v10.97,64.47 10.17,65.27 10.17,65.49 C5.1 | v10.97,56.69 10.97,56.46 12.12,55.32 U3.3 | v22.97,68.47 24.12,67.32 24.12,67.09 JP1.3 24.23,67.44 30.52,73.72 79.67,73.72 79.9,73.5 83.67,73.5 84.47,72.69 CN1.VBUS | U2.20 15.5,57.98 v15.5,58
  Bottom 0.381: v10.97,56.69 10.97,58 | 10.97,58 v10.97,64.47 14.97,68.47 v22.97,68.47 | v15.5,58 10.97,58
RXLED  (via drill 0.3)
  Top 0.305: v28.57,60.92 30.75,60.92 LED3.C | v17.6,56.81 17.83,56.81 17.95,56.69 18.75,56.69 U2.22
  Bottom 0.305: v28.57,60.92 21.72,60.92 v17.6,56.81
SCL  (via drill 0.3)
  Top 0.305: v10.63,53.49 6.17,57.95 6.17,61.49 R3.1 | v29.95,33.6 30.86,33.6 31.89,34.63 SJ2.1 | v44.01,34.29 45.83,36.12 v48.92,36.12 50.52,36.12 U4.P$26 | v66.18,36.12 67.44,36.12 | 67.44,36.12 69.04,36.12 U5.P$26 | v84.24,39.55 84.12,39.43 84.12,38.29 86.18,36.23 87.55,36.23 U6.P$26 | 67.44,36.12 v67.44,37.83
  Bottom 0.305: v10.63,53.49 10.86,53.49 22.52,41.83 22.52,41.03 v29.95,33.6 42.63,33.6 43.32,34.29 v44.01,34.29 | v66.18,36.12 62.87,36.12 62.52,35.78 49.26,35.78 v48.92,36.12 | v84.24,39.55 79.44,39.55 79.1,39.89 70.64,39.89 70.29,40.23 69.84,40.23 v67.44,37.83
SDA  (via drill 0.3)
  Top 0.305: v70.75,37.38 69.15,37.38 U5.P$27 | v85.95,37.38 87.55,37.38 U6.P$27 | v10.52,54.52 7.09,57.95 7.09,61.95 6.17,62.87 6.17,63.44 R2.1 | v28.92,37.38 29.95,36.35 SJ1.2 | 48.23,37.38 46.86,37.38 46.06,36.58 45.61,36.58 44.01,34.98 v43.32,34.98 | 48.23,37.38 50.52,37.38 U4.P$27 | v48.23,37.26 48.23,37.38
  Bottom 0.305: v85.95,37.38 81.61,33.03 72.81,33.03 71.55,34.29 71.55,36.58 v70.75,37.38 69.04,37.38 66.98,35.32 48.81,35.32 48.23,35.89 v48.23,37.26 | v10.52,54.52 22.97,42.06 22.97,41.26 26.86,37.38 v28.92,37.38 29.03,37.38 32.12,34.29 42.63,34.29 v43.32,34.98
TXLED  (via drill 0.3)
  Top 0.305: v30.75,57.95 30.75,57.04 LED2.C | v17.6,55.89 18.63,55.89 18.75,56.01 U2.23
  Bottom 0.305: v30.75,57.95 19.66,57.95 v17.6,55.89

### Text on the board
tNames: BLK | FTDI | GRN | GND | GP15 | VCC | GP2 | GND | VCC | CH_PD | 3x7 Segment / Richard Hawthorn / richardhawthorn.com | SDA | GP5 | GP4 | SCL | RH023.1 / Nov 2015
tDocu: REG